# Altium schematic sheet ArduinoFIO.SchDoc
size A4
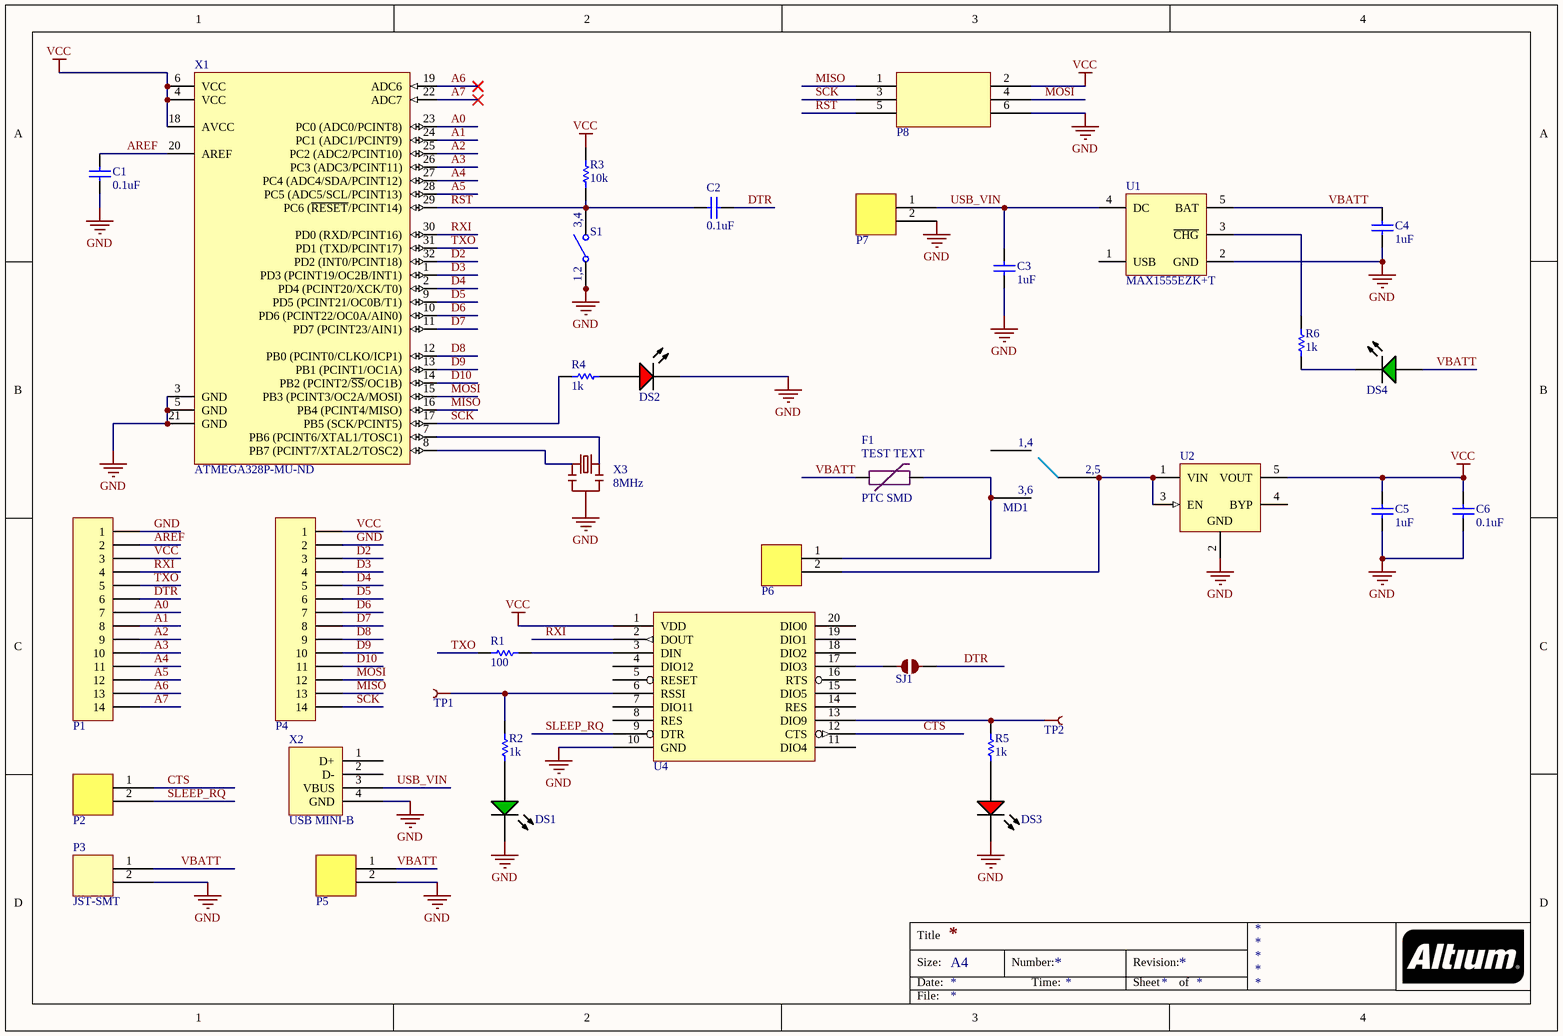
[diagram p0: ArduinoFIO.SchDoc]

## Parts
C1  value 0.1uF  [0402]  (hidden comment: C1005X7R1H104K050BB)
C2  value 0.1uF  [0402]  (hidden comment: C1005X7R1H104K050BB)
C3  value 1uF  [0402]  (hidden comment: GRM155R60J105KE19D)
C4  value 1uF  [0402]  (hidden comment: GRM155R60J105KE19D)
C5  value 1uF  [0402]  (hidden comment: GRM155R60J105KE19D)
C6  value 0.1uF  [0402]  (hidden comment: C1005X7R1H104K050BB)
DS1  LTST-C191KGKT  [KING-LED0603-25-GREEN_V]  (value not drawn)
DS2  LTST-C191KRKT  [KING-LED0603-25-RED_V]  (value not drawn)
DS3  LTST-C191KRKT  [KING-LED0603-25-RED_V]  (value not drawn)
DS4  LTST-C191KGKT  [KING-LED0603-25-GREEN_V]  (value not drawn)
F1  PTC SMD  [PTC-1206]
MD1  AYZ0202AGRLC  [DPDT SMD]  (value not drawn)
P1  95278-101A14LF  [1X14]  (value not drawn)
P2  961102-6404-AR  [1X02]  (value not drawn)
P3  JST-SMT  [S2B-PH]
P4  95278-101A14LF  [1X14]  (value not drawn)
P5  961102-6404-AR  [1X02]  (value not drawn)
P6  961102-6404-AR  [1X02]  (value not drawn)
P7  961102-6404-AR  [1X02]  (value not drawn)
P8  M20-9980346  [2X3]  (value not drawn)
R1  value 100  [J1-0603]  (hidden comment: RC0603FR-07100RL)
R2  value 1k  [J1-0603]  (hidden comment: RC0603JR-071KL)
R3  value 10k  [J1-0603]  (hidden comment: ERJ-3EKF1002V)
R4  value 1k  [J1-0603]  (hidden comment: RC0603JR-071KL)
R5  value 1k  [J1-0603]  (hidden comment: RC0603JR-071KL)
R6  value 1k  [J1-0603]  (hidden comment: RC0603JR-071KL)
S1  PTS645SH50SMTR92 LFS  [TACTILE SWITCH SMD]  (value not drawn)
SJ1  SOLDERJUMPERNC  [SJ_2S]  (value not drawn)
TP1  TEST-POINT3X5  [PAD.03X.05]  (value not drawn)  (no BOM)
TP2  TEST-POINT3X5  [PAD.03X.05]  (value not drawn)  (no BOM)
U1  MAX1555EZK+T  [SOT23-5]
U2  CAT6219-330TDGT3  [SOT23-5]  (value not drawn)
U4  XB24-API-001  [XBEE-SMD]  (value not drawn)
X1  Supplier Part Number 1: ATMEGA328P-MU-ND  [32A_N]  (hidden comment: ATMEGA328P-MU)
X2  USB MINI-B  [USB-MINIB]
X3  8MHz  [RESONATOR-SMD]

## Nets
GND: C1.1 C3.1 C4.1 C5.1 C6.1 DS1.2(K) DS2.2(K) DS3.2(K) P1.1 P3.2 P4.2 P5.2 P7.2 P8.6 S1.1 S1.2 U1.2(GND) U2.2(GND) U4.10(GND) X1.3(GND) X1.5(GND) X1.21(GND) X2.4(GND) X3.2
VCC: C5.2 C6.2 P1.3 P4.1 P8.2 R3.2 U2.5(VOUT) U4.1(VDD) X1.4(VCC) X1.6(VCC) X1.18(AVCC)
A0: P1.7 X1.23(PC0_(ADC0/PCINT8))
A1: P1.8 X1.24(PC1_(ADC1/PCINT9))
A2: P1.9 X1.25(PC2_(ADC2/PCINT10))
A3: P1.10 X1.26(PC3_(ADC3/PCINT11))
A4: P1.11 X1.27(PC4_(ADC4/SDA/PCINT12))
A5: P1.12 X1.28(PC5_(ADC5/SCL/PCINT13))
A6: P1.13 X1.19(ADC6)
A7: P1.14 X1.22(ADC7)
AREF: C1.2 P1.2 X1.20(AREF)
CTS: P2.1 U4.12(CTS)
D2: P4.3 X1.32(PD2_(INT0/PCINT18))
D3: P4.4 X1.1(PD3_(PCINT19/OC2B/INT1))
D4: P4.5 X1.2(PD4_(PCINT20/XCK/T0))
D5: P4.6 X1.9(PD5_(PCINT21/OC0B/T1))
D6: P4.7 X1.10(PD6_(PCINT22/OC0A/AIN0))
D7: P4.8 X1.11(PD7_(PCINT23/AIN1))
D8: P4.9 X1.12(PB0_(PCINT0/CLKO/ICP1))
D9: P4.10 X1.13(PB1_(PCINT1/OC1A))
D10: P4.11 X1.14(PB2_(PCINT2/~{SS}/OC1B))
DTR: C2.2 P1.6 SJ1.2
MISO: P4.13 P8.1 X1.16(PB4_(PCINT4/MISO))
MOSI: P4.12 P8.4 X1.15(PB3_(PCINT3/OC2A/MOSI))
RST: C2.1 P8.5 R3.1 S1.3 S1.4 X1.29(PC6_(~{RESET}/PCINT14))
RXI: P1.4 U4.2(DOUT) X1.30(PD0_(RXD/PCINT16))
SCK: P4.14 P8.3 R4.1 X1.17(PB5_(SCK/PCINT5))
SLEEP_RQ: P2.2 U4.9(DTR)
TXO: P1.5 R1.1 X1.31(PD1_(TXD/PCINT17))
USB_VIN: C3.2 P7.1 U1.4(DC) X2.3(VBUS)
VBATT: C4.2 DS4.1(A) F1.1 P3.1 P5.1 U1.5(BAT)
NetDS1_1: DS1.1(A) R2.1
NetDS2_1: DS2.1(A) R4.2
NetDS3_1: DS3.1(A) R5.1
NetDS4_2: DS4.2(K) R6.1
NetF1_2: F1.2 MD1.3 MD1.6 P6.1
NetMD1_1: MD1.1 MD1.4
NetMD1_2: MD1.2 MD1.5 P6.2 U2.1(VIN) U2.3(EN)
NetR1_2: R1.2 U4.3(DIN)
NetR2_2: R2.2 TP1.1 U4.6(RSSI)
NetR5_2: R5.2 TP2.1 U4.13(DIO9)
NetR6_2: R6.2 U1.3(~{CHG})
NetSJ1_1: SJ1.1 U4.17(DIO3)
NetX1_7: X1.7(PB6_(PCINT6/XTAL1/TOSC1)) X3.1
NetX1_8: X1.8(PB7_(PCINT7/XTAL2/TOSC2)) X3.3

Not connected (* = marked no-connect by the designer): U1 1(USB); U2 4(BYP); U4 4(DIO12) 5(RESET) 7(DIO11) 8(RES) 11(DIO4) 14(RES) 15(DIO5) 16(RTS) 18(DIO2) 19(DIO1) 20(DIO0); X2 1(D+) 2(D-)

## Notes on the sheet
- Title
- Size:
- Date:
- A4
- Number:
- Time:
- Revision:
- Sheet
- of
- File:
- (in symbol 0ZCJ0010FF2E) TEST TEXT
- (in symbol AYZ0202AGRLC) 1,4; 2,5; 3,6
- (in symbol PTS645SH50SMTR92 LFS) 3,4; 1,2

## Library data of the parts
C1 C2 C6 = C1005X7R1H104K050BB: CAP CER 0.1UF 50V 10% X7R 0402; Manufacturer: TDK Corporation; Capacitance: 0.1µF; Supplier 1: Digi-Key; Manufacturer Part Number: C1005X7R1H104K050BB; RoHS: RoHS Compliant; Category: Capacitors; Stock 1: 7100869; Pricing 1: 1=0.21, 10=0.14, 100=0.0664, 250=0.05592, 500=0.04684, 1000=0.03845, 5000=0.03251 (CAD); Packaging: Cut Tape (CT); Tolerance: ±10%; Voltage - Rated: 50V; Temperature Coefficient: X7R; Mounting Type: Surface Mount, MLCC; Operating Temperature: -55°C ~ 125°C; Applications: General Purpose; Ratings: -; Package / Case: 0402 (1005 Metric); Size / Dimension: 0.039" L x 0.020" W (1.00mm x 0.50mm); Height - Seated (Max): -; Thickness (Max): 0.022" (0.55mm); Lead Spacing: -; Features: -; Lead Style: -; ComponentLink1URL: http://product.tdk.com/en/catalog/datasheets/mlcc_commercial_general_en.pdf; ComponentLink1Description: http://product.tdk.com/en/catalog/datasheets/mlcc_commercial_general_en.pdf; Supplier Part Number 1: 445-5932-1-ND
C3-C5 = GRM155R60J105KE19D: CAP CER 1UF 6.3V 10% X5R 0402; Manufacturer: Murata Electronics North America; Capacitance: 1µF; Supplier 1: Digi-Key; Supplier Part Number 1: 490-1320-1-ND; Manufacturer Part Number: GRM155R60J105KE19D; RoHS: RoHS Compliant; Category: Capacitors; Stock 1: 7236741; Pricing 1: 1=0.14, 10=0.049, 50=0.0262, 100=0.0224, 250=0.01824, 500=0.0156, 1000=0.01217, 5000=0.01014 (CAD); Packaging: Cut Tape (CT); Tolerance: ±10%; Voltage - Rated: 6.3V; Temperature Coefficient: X5R; Mounting Type: Surface Mount, MLCC; Operating Temperature: -55°C ~ 85°C; Applications: General Purpose; Ratings: -; Package / Case: 0402 (1005 Metric); Size / Dimension: 0.039" L x 0.020" W (1.00mm x 0.50mm); Height - Seated (Max): -; Thickness (Max): 0.022" (0.55mm); Lead Spacing: -; Features: -; Lead Style: -; ComponentLink1URL: http://www.murata.com/~/media/webrenewal/support/library/catalog/products/capacitor/mlcc/c02e.ashx; ComponentLink1Description: http://www.murata.com/~/media/webrenewal/support/library/catalog/products/capacitor/mlcc/c02e.ashx
DS1 DS4 = LTST-C191KGKT: LED GREEN CLEAR THIN 0603 SMD; Manufacturer: Lite-On Inc.; Wavelength - Dominant: 571nm; Wavelength - Peak: 574nm; Millicandela Rating: 35mcd; Voltage - Forward (Vf) (Typ): 2V; Current - Test: 20mA; Viewing Angle: 130°; Lens Color: Colorless; Lens Style/Size: Rectangle with Flat Top, 1.10mm x 0.80mm; Supplier 1: Digi-Key; Supplier Part Number 1: 160-1446-6-ND; Manufacturer Part Number: LTST-C191KGKT; RoHS: RoHS Compliant; Category: Optoelectronics; Stock 1: 186242; Pricing 1: 1=0.42, 10=0.333, 100=0.1812, 250=0.1208, 500=0.10268, 1000=0.07853, 2500=0.07098 (CAD); Packaging: Digi-Reel®; Color: Green; Lens Transparency: Clear; Package / Case: 0603 (1608 Metric); Supplier Device Package: *; Size / Dimension: 1.60mm L x 0.80mm W; Height (Max): 0.55mm; Mounting Type: Surface Mount; ComponentLink1URL: http://optoelectronics.liteon.com/upload/download/DS22-2000-228/S_110_LTST-C191KGKT.pdf; ComponentLink1Description: http://optoelectronics.liteon.com/upload/download/DS22-2000-228/S_110_LTST-C191KGKT.pdf
DS2 DS3 = LTST-C191KRKT: LED SUPER RED CLR THIN 0603 SMD; Manufacturer: Lite-On Inc.; Wavelength - Dominant: 631nm; Wavelength - Peak: 639nm; Millicandela Rating: 54mcd; Voltage - Forward (Vf) (Typ): 2V; Current - Test: 20mA; Viewing Angle: 130°; Lens Transparency: Clear; Lens Color: Colorless; Lens Style/Size: Rectangle with Flat Top, 1.10mm x 0.80mm; Supplier 1: Digi-Key; Supplier Part Number 1: 160-1447-1-ND; Manufacturer Part Number: LTST-C191KRKT; RoHS: RoHS Compliant; Category: Optoelectronics; Stock 1: 239192; Pricing 1: 1=0.42, 10=0.333, 100=0.1812, 250=0.1208, 500=0.10268, 1000=0.07853, 2500=0.07098 (CAD); Packaging: Cut Tape (CT); Color: Red; Package / Case: 0603 (1608 Metric); Supplier Device Package: *; Size / Dimension: 1.60mm L x 0.80mm W; Height (Max): 0.55mm; Mounting Type: Surface Mount; ComponentLink1URL: http://optoelectronics.liteon.com/upload/download/DS22-2000-223/S_110_LTST-C191KRKT.pdf; ComponentLink1Description: http://optoelectronics.liteon.com/upload/download/DS22-2000-223/S_110_LTST-C191KRKT.pdf
F1 = 0ZCJ0010FF2E: PTC RESTTBLE 0.10A 60V CHIP 1206; Manufacturer: Bel Fuse Inc.; Current - Max: 10A; Current - Hold (Ih) (Max): 100mA; Current - Trip (It): 250mA; R Min/Max: 1.600 ~ 15.00 Ohm; Time to Trip: 1s; Supplier 1: Digi-Key; Supplier Part Number 1: 507-1794-1-ND; Manufacturer Part Number: 0ZCJ0010FF2E; RoHS: RoHS Compliant; Category: Circuit Protection; Stock 1: 174384; Pricing 1: 1=0.17, 10=0.15, 25=0.1388, 100=0.1246, 250=0.11104, 500=0.0925, 1000=0.08766 (CAD); Packaging: Cut Tape (CT); Voltage - Max: 60V; Package / Case: 1206 (3216 Metric), Concave; ComponentLink1URL: http://www.belfuse.com/pdfs/0ZCJ.pdf; ComponentLink1Description: http://www.belfuse.com/pdfs/0ZCJ.pdf
MD1 = AYZ0202AGRLC: SWITCH SLIDE DPDT 100MA 12V; Manufacturer: C&K Components; Contact Timing: Not Specified; Switch Function: On-On; Current Rating: 100mA (DC); Actuator Type: Standard; Actuator Length: 1.00mm; Actuator Material: Polyamide (PA46), Nylon 4/6, Glass Filled; Mechanical Life: 10,000 Cycles; Supplier 1: Digi-Key; Supplier Part Number 1: 401-2013-1-ND; Manufacturer Part Number: AYZ0202AGRLC; RoHS: RoHS Compliant; Category: Switches; Stock 1: 23014; Pricing 1: 1=1.86, 10=1.779, 25=1.7424, 50=1.5568, 100=1.4827, 250=1.44564, 500=1.22326, 1000=1.18619 (CAD); Packaging: Cut Tape (CT); Circuit: DPDT; Voltage Rating - AC: -; Voltage Rating - DC: 12V; Contact Material: Copper Alloy; Contact Finish: Silver; Mounting Type: Surface Mount; Termination Style: Gull Wing; Features: -; Switch Travel: -; Operating Temperature: -10°C ~ 60°C; Electrical Life: -; Operating Force: -; ComponentLink1URL: http://www.ck-components.com/index.php?module=media&action=Display&cmpref=14395&lang=en&width=&height=&format=&alt=; ComponentLink1Description: http://www.ck-components.com/index.php?module=media&action=Display&cmpref=14395&lang=en&width=&height=&format=&alt=
P1 P4 = 95278-101A14LF: BERGSTIK Header 14POS .100" DR SMT; Manufacturer: FCI; Connector Type: Header, Unshrouded; Number of Positions: 14; Number of Positions Loaded: All; Pitch: 0.100" (2.54mm); Supplier 1: Digi-Key; Supplier Part Number 1: 609-3485-1-ND; Manufacturer Part Number: 95278-101A14LF; RoHS: RoHS Compliant; Category: Connectors, Interconnects; Stock 1: 3673; Pricing 1: 1=1.9, 10=1.677, 25=1.5772, 50=1.5116, 100=1.446 (CAD); Packaging: Cut Tape (CT); Contact Type: Male Pin; Number of Rows: 2; Row Spacing: 0.100" (2.54mm); Contact Mating Length: 0.232" (5.90mm); Mounting Type: Surface Mount; Termination: Solder; Fastening Type: -; Features: -; Contact Finish: Gold, GXT™; Contact Finish Thickness: 30µin (0.76µm); Color: Black; ComponentLink1URL: http://portal.fciconnect.com/Comergent//fci/drawing/95278.pdf; ComponentLink1Description: http://portal.fciconnect.com/Comergent//fci/drawing/95278.pdf
P2 P5-P7 = 961102-6404-AR: CONN HEADER VERT SGL 2POS GOLD; Manufacturer: 3M; Connector Type: Header, Unshrouded; Number of Positions: 2; Number of Positions Loaded: All; Pitch: 0.100" (2.54mm); Supplier 1: Digi-Key; Supplier Part Number 1: 3M9447-ND; Manufacturer Part Number: 961102-6404-AR; RoHS: RoHS Compliant; Category: Connectors, Interconnects; Stock 1: 16484; Pricing 1: 1=0.22, 10=0.21, 25=0.1788, 50=0.1566, 100=0.1454, 250=0.12864, 500=0.12304, 1000=0.10068, 2500=0.09229 (CAD); Packaging: Bulk; Contact Type: Male Pin; Number of Rows: 1; Row Spacing: -; Contact Mating Length: 0.217" (5.50mm); Mounting Type: Through Hole; Termination: Solder; Fastening Type: -; Features: -; Contact Finish: Gold; Contact Finish Thickness: Flash; Color: Black; ComponentLink1URL: http://multimedia.3m.com/mws/mediawebserver?66666UuZjcFSLXTtNxTElX&VEVuQEcuZgVs6EVs6E666666--; ComponentLink1Description: http://multimedia.3m.com/mws/mediawebserver?66666UuZjcFSLXTtNxTElX&VEVuQEcuZgVs6EVs6E666666--
P3 = S2B-PH-SM4-TB(LF)(SN): CONN HEADER PH SIDE 2POS 2MM SMD; Manufacturer: JST Sales America Inc.; Connector Type: Header, Shrouded; Number of Positions: 2; Number of Positions Loaded: All; Pitch: 0.079" (2.00mm); Supplier 1: Digi-Key; Supplier Part Number 1: 455-1749-1-ND; Manufacturer Part Number: S2B-PH-SM4-TB(LF)(SN); RoHS: RoHS Compliant; Category: Connectors, Interconnects; Stock 1: 199364; Pricing 1: 1=0.78, 10=0.729, 25=0.6556, 50=0.5828, 100=0.5585, 250=0.50996, 500=0.48568 (CAD); Packaging: Cut Tape (CT); Contact Type: Male Pin; Number of Rows: 1; Row Spacing: -; Contact Mating Length: 0.130" (3.30mm); Mounting Type: Surface Mount, Right Angle; Termination: Solder; Fastening Type: Detent Lock; Features: Solder Retention; Contact Finish: Tin; Contact Finish Thickness: -; Color: Natural; ComponentLink1URL: http://www.jst-mfg.com/product/pdf/eng/ePH.pdf; ComponentLink1Description: http://www.jst-mfg.com/product/pdf/eng/ePH.pdf
P8 = M20-9980346: DIL VERTICAL PC TAIL PIN HEADER; Manufacturer: Harwin Inc.; Connector Type: Header, Unshrouded, Breakaway; Number of Positions: 6; Number of Positions Loaded: All; Pitch: 0.100" (2.54mm); Supplier 1: Digi-Key; Supplier Part Number 1: 952-2121-ND; Manufacturer Part Number: M20-9980346; RoHS: RoHS Compliant; Category: Connectors, Interconnects; Stock 1: 14297; Pricing 1: 1=0.32, 10=0.299, 25=0.2552, 50=0.2232, 100=0.2072, 250=0.18336, 500=0.17534, 1000=0.14346, 2500=0.13151 (CAD); Packaging: Bulk; Contact Type: Male Pin; Number of Rows: 2; Row Spacing: 0.100" (2.54mm); Contact Mating Length: 0.240" (6.10mm); Mounting Type: Through Hole; Termination: Solder; Fastening Type: -; Features: -; Contact Finish: Tin; Contact Finish Thickness: -; Color: Black; ComponentLink1URL: http://cdn.harwin.com/pdfs/M20-998.pdf; ComponentLink1Description: http://cdn.harwin.com/pdfs/M20-998.pdf
R1 = RC0603FR-07100RL: RES SMD 100 OHM 1% 1/10W 0603; Manufacturer: Yageo; Power (Watts): 0.1W, 1/10W; Temperature Coefficient: ±100ppm/°C; Supplier 1: Digi-Key; Manufacturer Part Number: RC0603FR-07100RL; RoHS: RoHS Compliant; Category: Resistors; Stock 1: 1476273; Pricing 1: 1=0.15, 10=0.021, 25=0.0148, 100=0.0085, 250=0.00648, 500=0.00518, 1000=0.00383, 2500=0.00332 (CAD); Packaging: Cut Tape (CT); Resistance (Ohms): 100; Tolerance: ±1%; Composition: Thick Film; Features: Moisture Resistant; Operating Temperature: -55°C ~ 155°C; Package / Case: 0603 (1608 Metric); Supplier Device Package: 0603; Size / Dimension: 0.063" L x 0.031" W (1.60mm x 0.80mm); Height: 0.022" (0.55mm); Number of Terminations: 2; ComponentLink1URL: http://www.yageo.com/NewPortal/yageodocoutput?fileName=/pdf/R-Chip/PYu-RC_Group_51_RoHS_L_3.pdf; ComponentLink1Description: http://www.yageo.com/NewPortal/yageodocoutput?fileName=/pdf/R-Chip/PYu-RC_Group_51_RoHS_L_3.pdf; Supplier Part Number 1: 311-100HRCT-ND
R2 R4-R6 = RC0603JR-071KL: RES SMD 1K OHM 5% 1/10W 0603; Manufacturer: Yageo; Power (Watts): 0.1W, 1/10W; Temperature Coefficient: ±100ppm/°C; Supplier 1: Digi-Key; Supplier Part Number 1: 311-1.0KGRCT-ND; Manufacturer Part Number: RC0603JR-071KL; RoHS: RoHS Compliant; Category: Resistors; Stock 1: 1746734; Pricing 1: 1=0.15, 10=0.016, 25=0.012, 100=0.0066, 250=0.005, 500=0.00402, 1000=0.00295, 2500=0.00256 (CAD); Packaging: Cut Tape (CT); Resistance (Ohms): 1k; Tolerance: ±5%; Composition: Thick Film; Features: Moisture Resistant; Operating Temperature: -55°C ~ 155°C; Package / Case: 0603 (1608 Metric); Supplier Device Package: 0603; Size / Dimension: 0.063" L x 0.031" W (1.60mm x 0.80mm); Height: 0.022" (0.55mm); Number of Terminations: 2; ComponentLink1URL: http://www.yageo.com/NewPortal/yageodocoutput?fileName=/pdf/R-Chip/PYu-RC_Group_51_RoHS_L_3.pdf; ComponentLink1Description: http://www.yageo.com/NewPortal/yageodocoutput?fileName=/pdf/R-Chip/PYu-RC_Group_51_RoHS_L_3.pdf
R3 = ERJ-3EKF1002V: RES SMD 10K OHM 1% 1/10W 0603; Manufacturer: Panasonic Electronic Components; Power (Watts): 0.1W, 1/10W; Temperature Coefficient: ±100ppm/°C; Supplier 1: Digi-Key; Manufacturer Part Number: ERJ-3EKF1002V; RoHS: RoHS Compliant; Category: Resistors; Stock 1: 5981773; Pricing 1: 1=0.15, 50=0.017, 100=0.0125, 250=0.0096, 500=0.00766, 1000=0.00564 (CAD); Packaging: Cut Tape (CT); Resistance (Ohms): 10k; Tolerance: ±1%; Composition: Thick Film; Features: Automotive AEC-Q200; Operating Temperature: -55°C ~ 155°C; Package / Case: 0603 (1608 Metric); Supplier Device Package: 0603; Size / Dimension: 0.063" L x 0.031" W (1.60mm x 0.80mm); Height: 0.022" (0.55mm); Number of Terminations: 2; ComponentLink1URL: http://industrial.panasonic.com/www-cgi/jvcr13pz.cgi?E+PZ+3+AOA0002+ERJ3EKF1002V+7+WW; ComponentLink1Description: http://industrial.panasonic.com/www-cgi/jvcr13pz.cgi?E+PZ+3+AOA0002+ERJ3EKF1002V+7+WW; Supplier Part Number 1: P10.0KHCT-ND
S1 = PTS645SH50SMTR92 LFS: SWITCH TACTILE SPST-NO 0.05A 12V; Manufacturer: C&K Components; Switch Function: Off-Mom; Contact Rating @ Voltage: 0.05A @ 12VDC; Actuator Type: Standard; Actuator Height off PCB, from Pins: 5.00mm; Actuator Orientation: Top Actuated; Outline: 6.00mm x 6.00mm; Illumination: Non-Illuminated; Operating Force: 200gf; Actuator Material: Polyamide (PA66), Nylon 6/6; Mechanical Life: 100,000 Cycles; Supplier 1: Digi-Key; Supplier Part Number 1: CKN9085CT-ND; Manufacturer Part Number: PTS645SH50SMTR92 LFS; RoHS: RoHS Compliant; Category: Switches; Stock 1: 49163; Pricing 1: 1=0.43, 10=0.418, 25=0.404, 50=0.3892, 100=0.3675, 250=0.34592, 500=0.3315 (CAD); Packaging: Cut Tape (CT); Circuit: SPST-NO; Mounting Type: Surface Mount; Termination Style: Gull Wing; Illumination Voltage (Nominal): -; Illumination Type, Color: -; Ingress Protection: -; Features: -; Switch Travel: -; Operating Temperature: -20°C ~ 60°C; ComponentLink1URL: http://www.ck-components.com/14409/pts645_25apr13.pdf/; ComponentLink1Description: http://www.ck-components.com/14409/pts645_25apr13.pdf/
SJ1 = SOLDERJUMPERNC: =SupplierDescription
TP1 TP2 = TEST-POINT3X5: =SupplierDescription
U1 = MAX1555EZK+T: IC BATT CHRGR LI+ 1CELL SOT23-5; Manufacturer: Maxim Integrated; Function: Charge Management; Battery Chemistry: Li-Ion, Li-Pol; Voltage - Supply: 3.7 V ~ 7 V; Supplier 1: Digi-Key; Supplier Part Number 1: MAX1555EZK+TCT-ND; Manufacturer Part Number: MAX1555EZK+T; RoHS: RoHS Compliant; Category: Integrated Circuits (ICs); Stock 1: 1085; Pricing 1: 1=2.84, 10=2.675, 25=2.1392, 50=2.0326, 100=1.872, 250=1.77568, 500=1.71148 (CAD); Packaging: Cut Tape (CT); Operating Temperature: -40°C ~ 85°C; Mounting Type: Surface Mount; Package / Case: SOT-23-5 Thin, TSOT-23-5; Supplier Device Package: TSOT-23-5; ComponentLink1URL: http://datasheets.maximintegrated.com/en/ds/MAX1551-MAX1555.pdf; ComponentLink1Description: http://datasheets.maximintegrated.com/en/ds/MAX1551-MAX1555.pdf
U2 = CAT6219-330TDGT3: IC REG LDO 3.3V 0.5A TSOT23-5; Manufacturer: ON Semiconductor; Regulator Topology: Positive Fixed; Current - Output: 500mA; Voltage - Dropout (Typical): 0.3V @ 500mA; Number of Regulators: 1; Voltage - Input: Up to 5.5V; Supplier 1: Digi-Key; Supplier Part Number 1: CAT6219-330TDGT3CT-ND; Manufacturer Part Number: CAT6219-330TDGT3; RoHS: RoHS Compliant; Category: Integrated Circuits (ICs); Stock 1: 4724; Pricing 1: 1=1.36, 10=1.204, 25=1.0872, 100=0.9514, 250=0.83436, 500=0.73996, 1000=0.58518 (CAD); Packaging: Cut Tape (CT); Voltage - Output: 3.3V; Current - Limit (Min): -; Operating Temperature: -40°C ~ 125°C; Mounting Type: Surface Mount; Package / Case: SOT-23-5 Thin, TSOT-23-5; Supplier Device Package: TSOT-23-5; ComponentLink1URL: http://www.onsemi.com/pub_link/Collateral/CAT6219-D.PDF; ComponentLink1Description: http://www.onsemi.com/pub_link/Collateral/CAT6219-D.PDF
U4 = XB24-API-001: MOD XBEE 802.15.4 1MW W/PCB ANT; Manufacturer: Digi International; Frequency: 2.4GHz; Data Rate (Max): 250kbps; Power - Output: 0dBm; Sensitivity: -92dBm; Voltage - Supply: 2.8 V ~ 3.4 V; Current - Receiving: 50mA; Current - Transmitting: 45mA; Data Interface: PCB, Through Hole; Antenna Connector: On-Board, Trace; Supplier 1: Digi-Key; Supplier Part Number 1: 602-1273-ND; Manufacturer Part Number: XB24-API-001; RoHS: RoHS Compliant; Category: RF/IF and RFID; Stock 1: 2317; Pricing 1: 1=26.57 (CAD); Packaging: Bulk; Modulation or Protocol: 802.15.4; Applications: Home/Building Automation, Industrial Control, ZigBee™; Memory Size: -; Operating Temperature: -40°C ~ 85°C; Package / Case: Module; ComponentLink1URL: http://www.digi.com/pdf/ds_xbeemultipointmodules.pdf; ComponentLink1Description: http://www.digi.com/pdf/ds_xbeemultipointmodules.pdf
X1 = ATMEGA328P-MU: IC MCU 8BIT 32KB FLASH 32QFN; Manufacturer: Atmel; Core Processor: AVR; Core Size: 8-Bit; Speed: 20MHz; Connectivity: I²C, SPI, UART/USART; Peripherals: Brown-out Detect/Reset, POR, PWM, WDT; Number of I/O: 23; Program Memory Size: 32KB (16K x 16); EEPROM Size: 1K x 8; RAM Size: 2K x 8; Voltage - Supply (Vcc/Vdd): 1.8 V ~ 5.5 V; Data Converters: A/D 8x10b; Oscillator Type: Internal; Supplier 1: Digi-Key; Manufacturer Part Number: ATMEGA328P-MU; RoHS: RoHS Compliant; Category: Integrated Circuits (ICs); Stock 1: 70195; Pricing 1: 1=5.01, 10=4.465, 100=3.6608, 250=3.30364, 500=2.96432, 1000=2.50003 (CAD); Packaging: Tray; Program Memory Type: FLASH; Operating Temperature: -40°C ~ 85°C; Package / Case: 32-VFQFN Exposed Pad; Supplier Device Package: 32-VQFN (5x5); ComponentLink1URL: http://www.atmel.com/images/atmel-8271-8-bit-avr-microcontroller-atmega48a-48pa-88a-88pa-168a-168pa-328-328p_datasheet_summary.pdf; ComponentLink1Description: http://www.atmel.com/images/atmel-8271-8-bit-avr-microcontroller-atmega48a-48pa-88a-88pa-168a-168pa-328-328p_datasheet_summary.pdf
X2 = 10033526-N3212LF: CONN MINI USB RCPT RA TYPE B SMD; Manufacturer: FCI; Connector Type: USB - mini B; Number of Contacts: 5; Gender: Receptacle; Supplier 1: Digi-Key; Supplier Part Number 1: 609-4700-1-ND; Manufacturer Part Number: 10033526-N3212LF; RoHS: RoHS Compliant; Category: Connectors, Interconnects; Stock 1: 15539; Pricing 1: 1=0.99, 10=0.928, 25=0.836, 50=0.743, 100=0.7121, 250=0.6502 (CAD); Packaging: Cut Tape (CT); Specifications: -; Mounting Type: Surface Mount, Right Angle, Horizontal; Features: Board Guide, Solder Retention; Ingress Protection: -; ComponentLink1URL: http://portal.fciconnect.com/Comergent//fci/drawing/10033526.pdf; ComponentLink1Description: http://portal.fciconnect.com/Comergent//fci/drawing/10033526.pdf
X3 = CSTCE10M0G55Z-R0: CER RESONATOR 10MHZ SMD; Manufacturer: Murata Electronics North America; Frequency Stability: ±0.2%; Frequency Tolerance: ±0.5%; Capacitance: 33pF; Supplier 1: Digi-Key; Supplier Part Number 1: 490-4715-1-ND; Manufacturer Part Number: CSTCE10M0G55Z-R0; RoHS: RoHS Compliant; Category: Crystals and Oscillators; Stock 1: 14995; Pricing 1: 1=0.69, 10=0.573, 50=0.5166, 100=0.4596, 500=0.43548, 1000=0.36763 (CAD); Packaging: Cut Tape (CT); Frequency: 10MHz; Type: Ceramic; Features: Built in Capacitor; Impedance: -; Operating Temperature: -40°C ~ 125°C; Mounting Type: Surface Mount; Package / Case: 3-SMD, Non-Standard; Size / Dimension: 0.126" L x 0.051" W (3.20mm x 1.30mm); Height: 0.031" (0.80mm); ComponentLink1URL: http://www.murata.com/~/media/webrenewal/support/library/catalog/products/timingdevice/ceralock/p16e.ashx; ComponentLink1Description: http://www.murata.com/~/media/webrenewal/support/library/catalog/products/timingdevice/ceralock/p16e.ashx